# EasyEDA schematic SCH_MIW PCB No PS_2022-01-17.json

## Sheets
1 TTGO_CIRCUIT_PCB: TITLE: ESP32_CIRCUIT With Dial; REV: 1.2; Date: 2020-12-28; Sheet: 1/1; Drawn By: Martin Nohr; Company: Nohr Photo
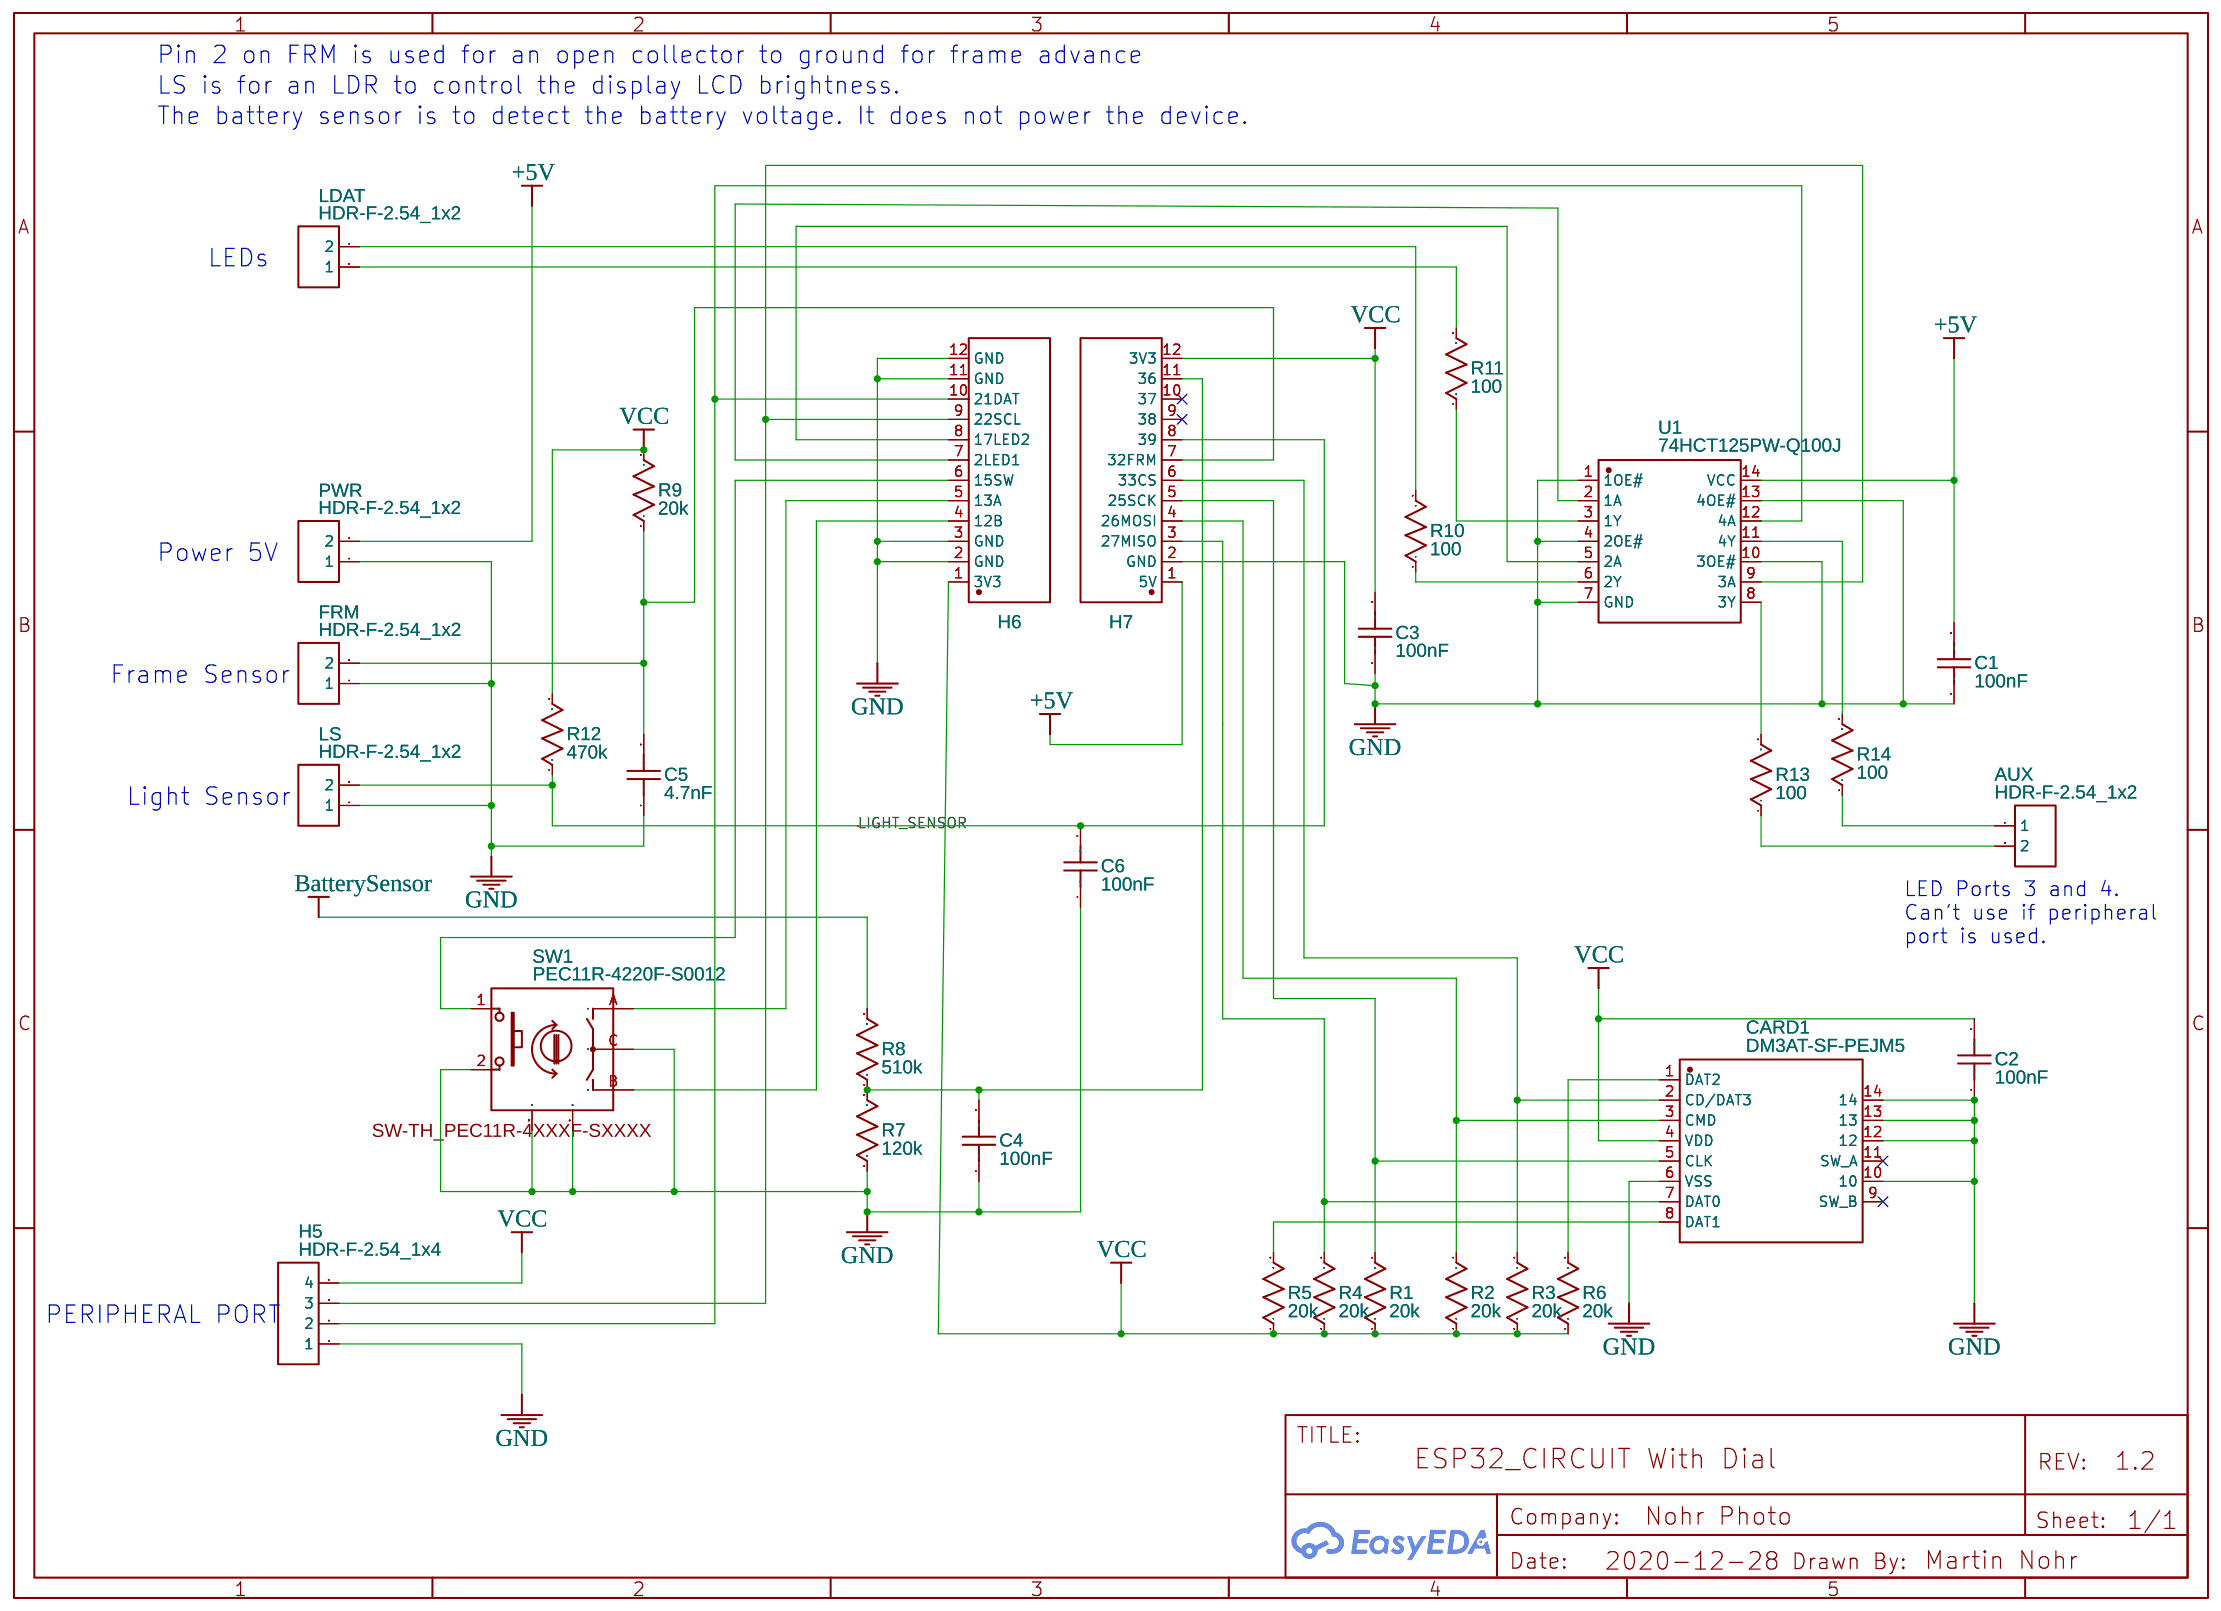
[diagram p0: TTGO_CIRCUIT_PCB]
2 TTGO External Components: TITLE: External Wiring; REV: 1.1; Date: 2020-09-08; Drawn By: MartinNohr
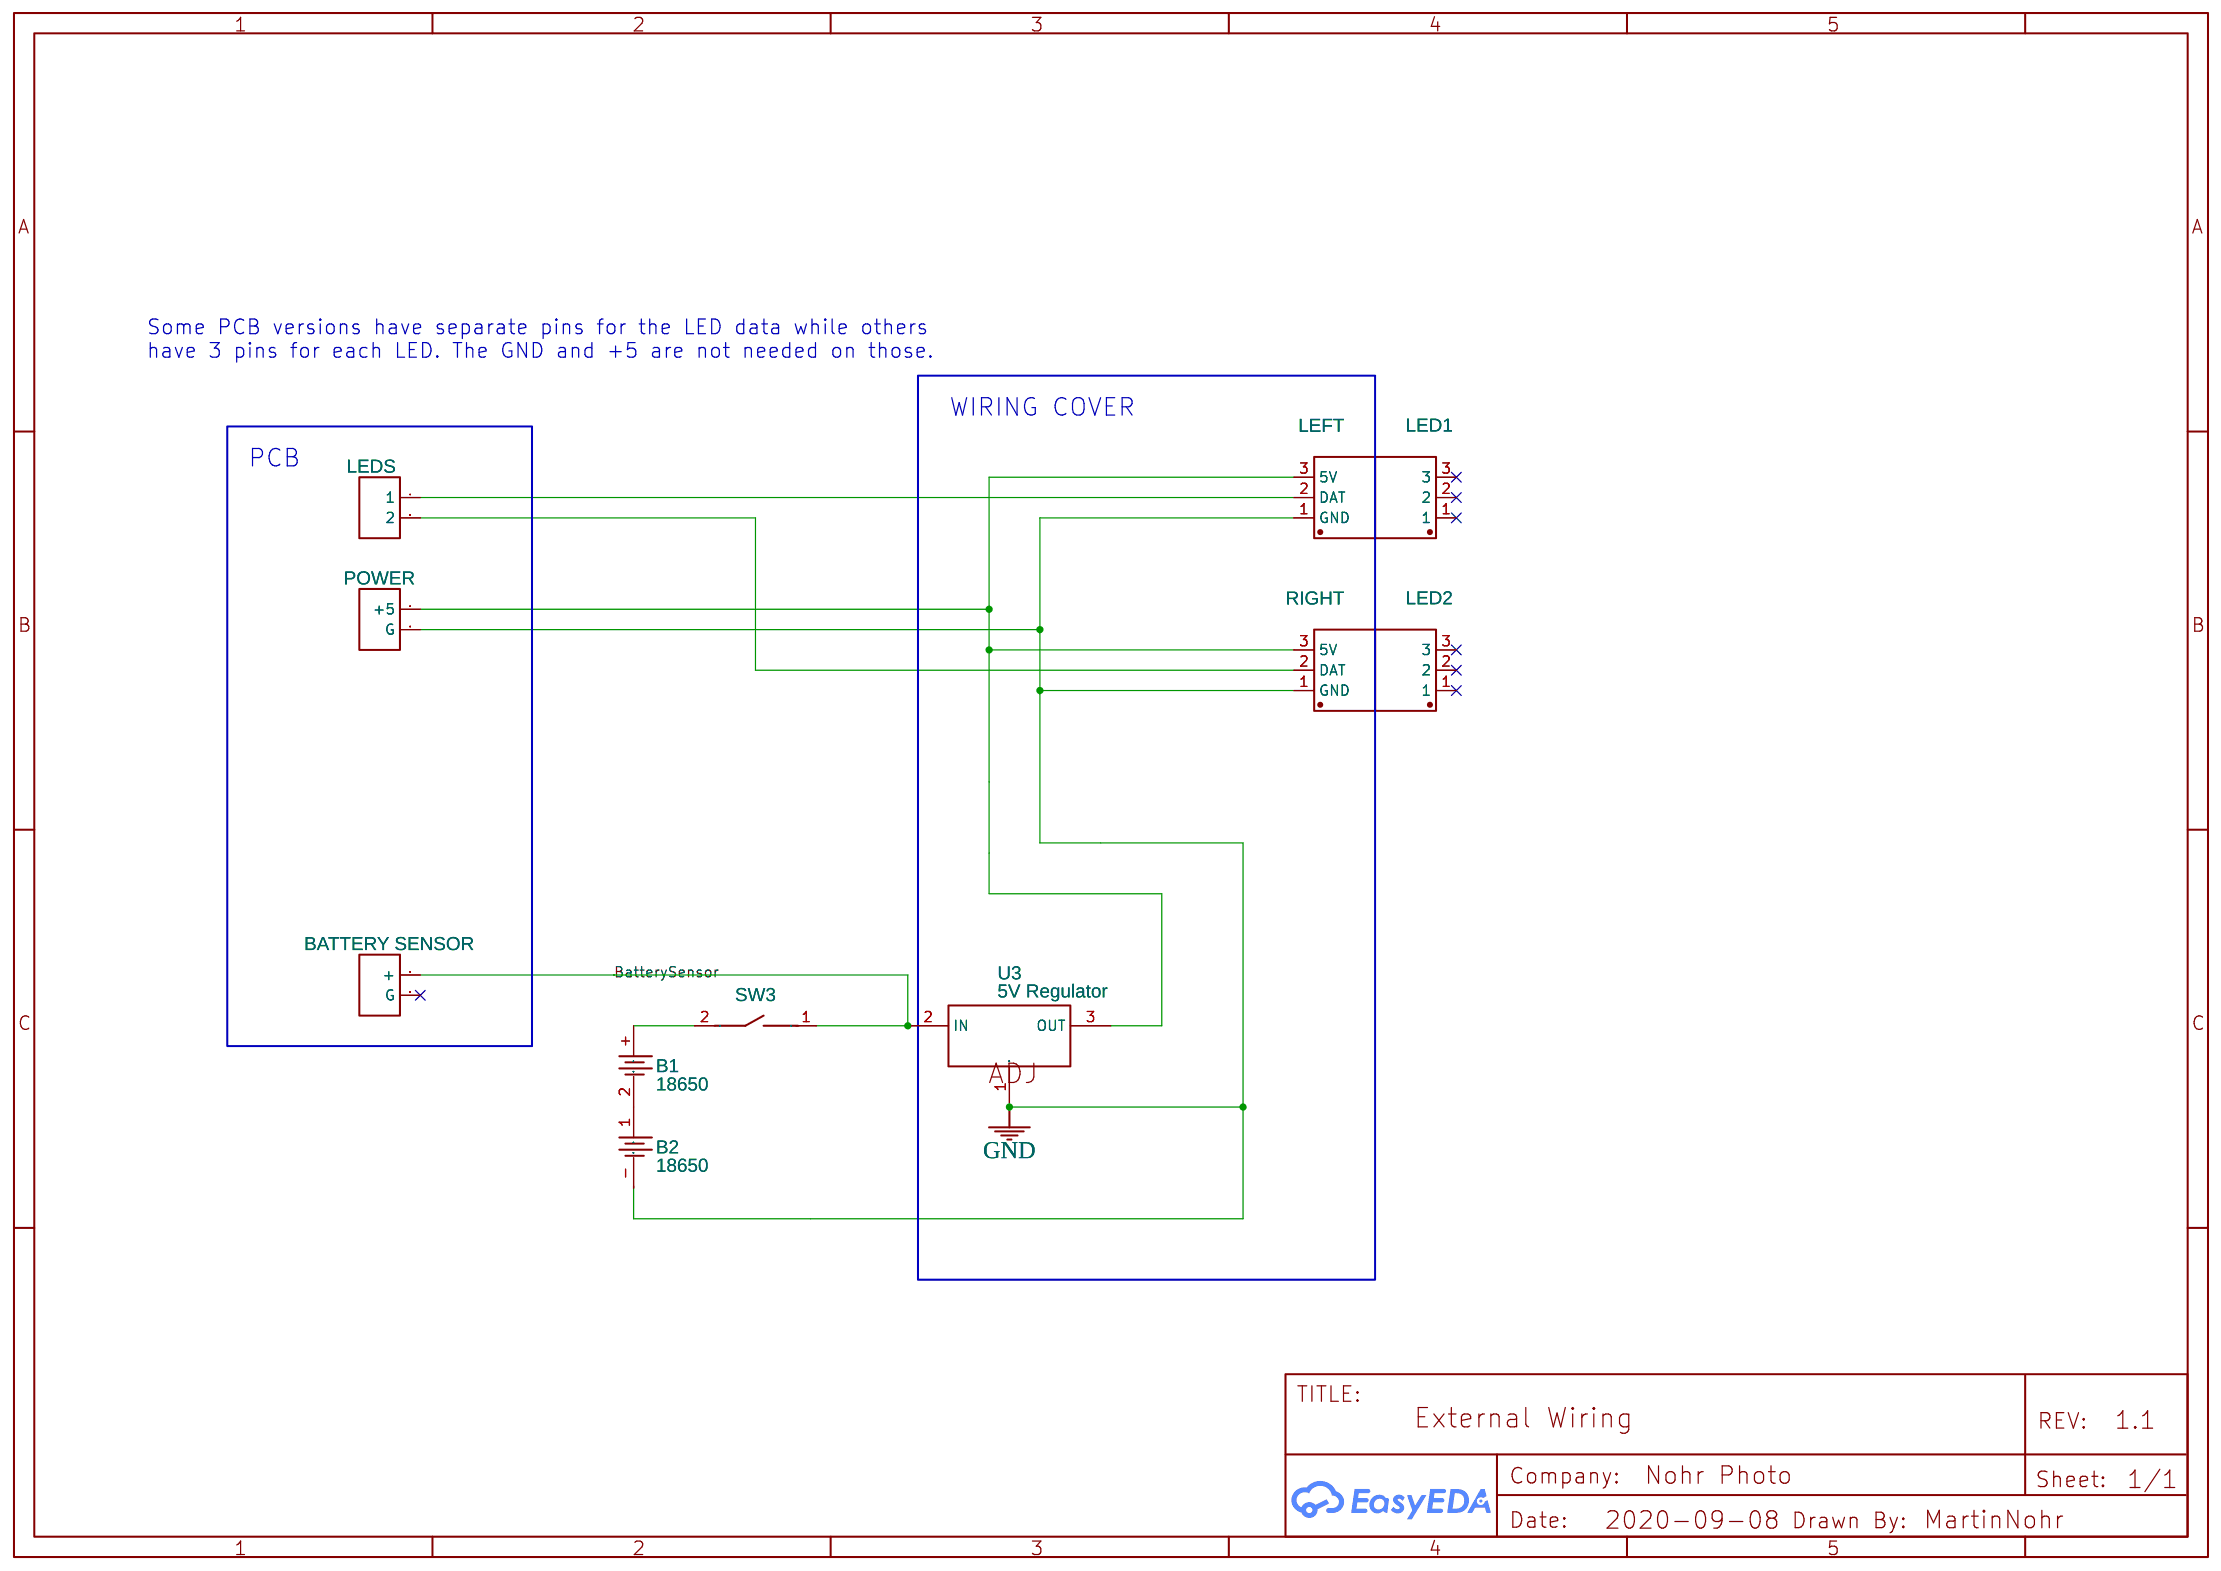
[diagram p1: TTGO External Components]

## Parts
sheet TTGO External Components
B1  18650  [BAT-SMD_CR1220-2]
B2  18650  [BAT-SMD_CR1220-2]
H1  LEDS  [HDR-F-2.54_1X2]
H10  POWER  [HDR-F-2.54_1X2]
H12  BATTERY SENSOR  [HDR-F-2.54_1X2]
LED1  68000-103HLF  [HDR-TH_3P-P2.54-V]
LED2  68000-103HLF  [HDR-TH_3P-P2.54-V]
LEFT  68000-103HLF  [HDR-TH_3P-P2.54-V]
RIGHT  68000-103HLF  [HDR-TH_3P-P2.54-V]
SW3  SWITCH,6*6*5PLASTIC HEAD,260G, 0.25MM,DIP2  [KEY-TH_2P-L6.0-W6.0-P5.00]
U3  5V Regulator  [TO-263-2_L10.1-W9.1-P5.08-LS15.2-BR]
sheet TTGO_CIRCUIT_PCB
AUX  HDR-F-2.54_1x2  [HDR-F-2.54_1X2]
C1  100nF  [C0603]
C2  100nF  [C0603]
C3  100nF  [C0603]
C4  100nF  [C0603]
C5  4.7nF  [C0603]
C6  100nF  [C0603]
CARD1  DM3AT-SF-PEJM5  [SD-SMD_DM3AT-SF-PEJM5]
FRM  HDR-F-2.54_1x2  [HDR-F-2.54_1X2]
H5  HDR-F-2.54_1x4  [HDR-F-2.54_1X4]
H6  A2541HWV-12P  [HDR-TH_12P-P2.54-V_A2541HWV-12P]
H7  A2541HWV-12P  [HDR-TH_12P-P2.54-V_A2541HWV-12P]
LDAT  HDR-F-2.54_1x2  [HDR-F-2.54_1X2]
LS  HDR-F-2.54_1x2  [HDR-F-2.54_1X2]
PWR  HDR-F-2.54_1x2  [HDR-F-2.54_1X2]
R1  20k  [R0603]
R2  20k  [R0603]
R3  20k  [R0603]
R4  20k  [R0603]
R5  20k  [R0603]
R6  20k  [R0603]
R7  120k  [R0603]
R8  510k  [R0603]
R9  20k  [R0603]
R10  100  [R0603]
R11  100  [R0603]
R12  470k  [R0603]
R13  100  [R0603]
R14  100  [R0603]
SW1  PEC11R-4220F-S0012  [SW-TH_PEC11R-4XXXF-SXXXX]
U1  74HCT125PW-Q100J  [TSSOP-14_L5.0-W4.4-P0.65-LS6.4-BL]

## Library data of the parts
B1 B2 = CR1220-2: Supplier: LCSC; Manufacturer: Q&J; image: //image.lceda.cn/szlcsc/C70381.jpg; Supplier Part: C70381
AUX FRM H1 H10 H12 LDAT LS PWR = HDR-F-2.54_1x2: Supplier Part: C49661; Supplier: LCSC; Contributor: LCEDA_Lib
LED1 LED2 LEFT RIGHT = 68000-103HLF: Supplier: LCSC; Supplier Part: C168677; Manufacturer: Amphenol ICC; Contributor: LCSC
SW3 = SWITCH,6*6*5PLASTIC HEAD,260G, 0.25MM,DIP2: Supplier: LCSC; Manufacturer: BBJ; Manufacturer Part: Switch,6*6*5Plastic head,260G, 0.25mm,DIP2; Contributor: LCSC; Supplier Part: C71845
U3 = LM337(TO-263): Supplier: LCSC; Manufacturer: ON; Manufacturer Part: LM337D2TG; Contributor: LCEDA_Lib; Supplier Part: C146782
C1-C4 C6 = CL10B104KB8NFNC: Supplier: LCSC; Supplier Part: C15725; Manufacturer: SAMSUNG; Manufacturer Part: CL10B104KC8NNNC; Contributor: LCSC
C5 = CL10B104KB8NFNC: Supplier: LCSC; Supplier Part: C106218; Manufacturer: YAGEO; Manufacturer Part: CC0603KRX7R9BB472; Contributor: LCSC
CARD1 = DM3AT-SF-PEJM5: Supplier: LCSC; Supplier Part: C114218; Manufacturer: Hirose; Contributor: LCSC
H5 = HDR-F-2.54_1x4: Supplier Part: C225501; Supplier: LCSC; Contributor: LCEDA_Lib
H6 H7 = A2541HWV-12P: Supplier: LCSC; Supplier Part: C225509; Manufacturer: Changjiang Connectors; Contributor: LCSC; LCSC Assembly: Yes; SMT Type: Extend
R1-R6 R9 = R_0603_US: Supplier Part: C4184; Supplier: LCSC; Contributor: LCEDA_Lib; Manufacturer Part: 0603WAF2002T5E; Manufacturer: UniOhm
R7 = R_0603_US: Supplier Part: C25808; Supplier: LCSC; Contributor: LCEDA_Lib; Manufacturer Part: 0603WAF1203T5E; Manufacturer: UniOhm
R8 = R_0603_US: Supplier Part: C23192; Supplier: LCSC; Contributor: LCEDA_Lib; Manufacturer Part: 0603WAF5103T5E; Manufacturer: UniOhm
R10 R11 R13 R14 = R_0603_US: Supplier Part: C22775; Supplier: LCSC; Contributor: LCEDA_Lib; Manufacturer Part: 0603WAF1000T5E; Manufacturer: UniOhm
R12 = R_0603_US: Supplier Part: C23178; Supplier: LCSC; Contributor: LCEDA_Lib; Manufacturer Part: 0603WAF4703T5E; Manufacturer: UniOhm
SW1 = PEC11R-4015F-S0024: Supplier: LCSC; Supplier Part: C143817; Manufacturer: BOURNS; Contributor: LCSC; Package Display: Yes
U1 = 74HCT125PW-Q100J: Supplier: LCSC; Supplier Part: C545658; Manufacturer: Nexperia; Contributor: LCSC; JLCPCB Part Class: Extended Part

## Nets
+5V: C1.2 H7.1(5V) PWR.2 U1.14(VCC)
GND: B2.-(2) C1.1 C2.1 C3.1 C4.1 C5.1 C6.1 CARD1.6(VSS) CARD1.10 CARD1.12 CARD1.13 CARD1.14 FRM.1 H5.1 H6.2(GND) H6.3(GND) H6.11(GND) H6.12(GND) H7.2(GND) H10.2(G) LEFT.1(GND) LS.1 PWR.1 R7.1 RIGHT.1(GND) SW1.2 SW1.C SW1.MT1 SW1.MT2 U1.1(1OE#) U1.4(2OE#) U1.7(GND) U1.10(3OE#) U1.13(4OE#) U3.1(ADJ)
VCC: C2.2 C3.2 CARD1.4(VDD) H5.4 H6.1(3V3) H7.12(3V3) R1.1 R2.1 R3.1 R4.1 R5.1 R6.1 R9.2 R12.2
BatterySensor: H12.1(+) R8.2 SW3.1 U3.2(IN)
LIGHT_SENSOR: C6.2 H7.8(39) LS.2 R12.1
Net-(AUX-1): AUX.1 R14.1
Net-(AUX-2): AUX.2 R13.1
Net-(B1-2): B1.2 B2.1
Net-(B1-+): B1.+(1) SW3.2
Net-(C4-2): C4.2 H7.11(36) R7.2 R8.1
Net-(C5-2): C5.2 FRM.2 H7.7(32FRM) R9.1
Net-(CARD1-1): CARD1.1(DAT2) R6.2
Net-(CARD1-2): CARD1.2(CD/DAT3) H7.6(33CS) R3.2
Net-(CARD1-3): CARD1.3(CMD) H7.4(26MOSI) R2.2
Net-(CARD1-5): CARD1.5(CLK) H7.5(25SCK) R1.2
Net-(CARD1-7): CARD1.7(DAT0) H7.3(27MISO) R4.2
Net-(CARD1-8): CARD1.8(DAT1) R5.2
Net-(H1-1): H1.1 LEFT.2(DAT)
Net-(H1-2): H1.2 RIGHT.2(DAT)
Net-(H5-2): H5.2 H6.10(21DAT) U1.12(4A)
Net-(H5-3): H5.3 H6.9(22SCL) U1.9(3A)
Net-(H6-4): H6.4(12B) SW1.B
Net-(H6-5): H6.5(13A) SW1.A
Net-(H6-6): H6.6(15SW) SW1.1
Net-(H6-7): H6.7(2LED1) U1.2(1A)
Net-(H6-8): H6.8(17LED2) U1.5(2A)
Net-(H10-1): H10.1(+5) LEFT.3(5V) RIGHT.3(5V) U3.3(OUT)
Net-(LDAT-1): LDAT.1 R11.2
Net-(LDAT-2): LDAT.2 R10.2
Net-(R10-1): R10.1 U1.6(2Y)
Net-(R11-1): R11.1 U1.3(1Y)
Net-(R13-2): R13.2 U1.8(3Y)
Net-(R14-2): R14.2 U1.11(4Y)

Not connected (* = marked no-connect by the designer): CARD1 9(SW_B)* 11(SW_A)*; H7 9(38)* 10(37)*; H12 2(G)*; LED1 1* 2* 3*; LED2 1* 2* 3*

## Notes on the sheets
sheet 1
- Pin 2 on FRM is used for an open collector to ground for frame advance
- LS is for an LDR to control the display LCD brightness.
- The battery sensor is to detect the battery voltage. It does not power the device.
- LEDs
- Power 5V
- Frame Sensor
- Light Sensor
- LED Ports 3 and 4.
  Can't use if peripheral
  port is used.
- PERIPHERAL PORT
sheet 2
- Some PCB versions have separate pins for the LED data while others
  have 3 pins for each LED. The GND and +5 are not needed on those.
- WIRING COVER
- PCB
